# EAGLE design perch_pcb_v1 (EAGLE 7.6.0)
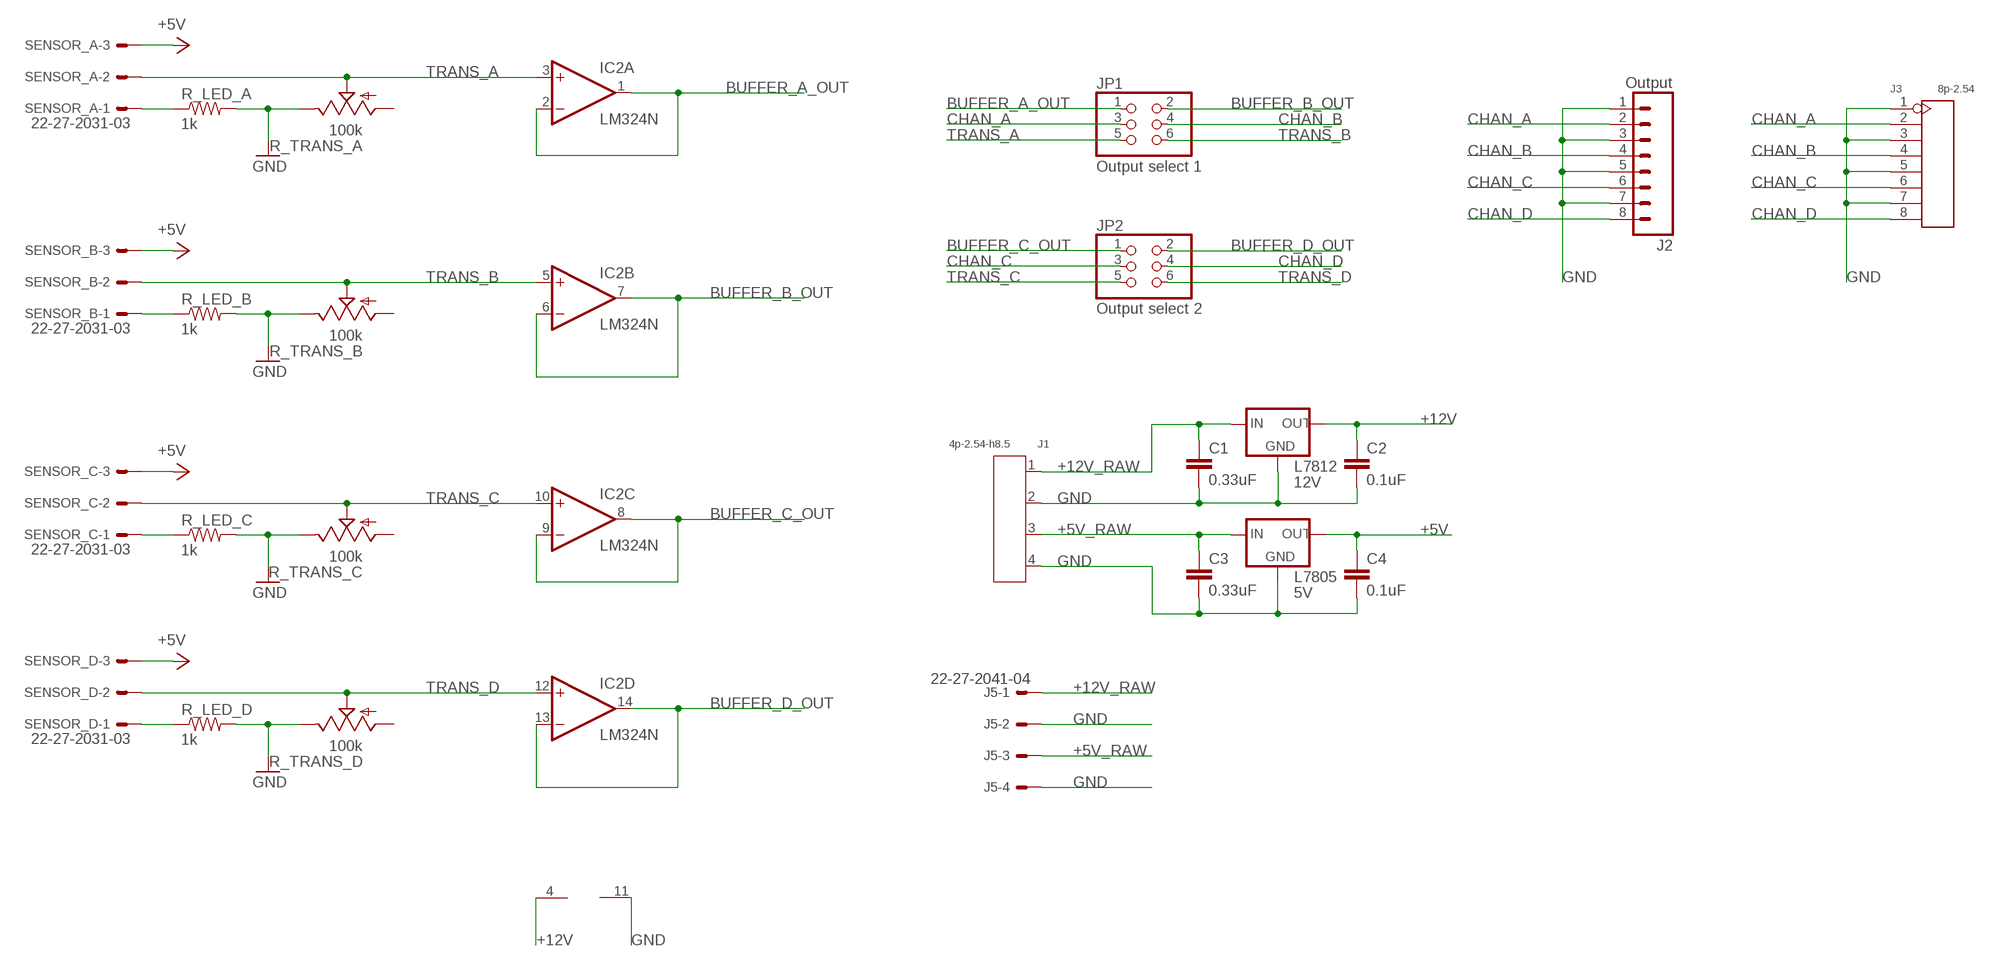
[diagram p0: schematic, sheet 1]

## Parts
C1  0.33uF  CAPPTH  [CAP-PTH-SMALL]
C2  0.1uF  CAPPTH  [CAP-PTH-SMALL]
C3  0.33uF  CAPPTH  [CAP-PTH-SMALL]
C4  0.1uF  CAPPTH  [CAP-PTH-SMALL]
IC2  LM324N  [DIL14]
J1  4p-2.54-h8.5  DIP-SCREW-TERMINAL-GREEN(4P-2.54-H8.5)  [H4-2.54-8.52X6.3MM]
J2  Output  M08  [1X08_ROUND]
J3  8p-2.54  DIP-SCREW-TERMINAL(8P-2.54)  [H8-2.54-18.7X6.3MM]
J5  22-27-2041-04  [6410-04]
JP1  Output select 1  PINHD-2X3  [2X03]
JP2  Output select 2  PINHD-2X3  [2X03]
L7805  5V  V_REG_78XXSINK  [TO220-IGO]
L7812  12V  V_REG_78XXSINK  [TO220-IGO]
R_LED_A  1k  RESISTORAXIAL-0.3  [AXIAL-0.3]
R_LED_B  1k  RESISTORAXIAL-0.3  [AXIAL-0.3]
R_LED_C  1k  RESISTORAXIAL-0.3  [AXIAL-0.3]
R_LED_D  1k  RESISTORAXIAL-0.3  [AXIAL-0.3]
R_TRANS_A  100k  TRIM_US-B64W  [B64W]
R_TRANS_B  100k  TRIM_US-B64W  [B64W]
R_TRANS_C  100k  TRIM_US-B64W  [B64W]
R_TRANS_D  100k  TRIM_US-B64W  [B64W]
SENSOR_A  22-27-2031-03  [6410-03]
SENSOR_B  22-27-2031-03  [6410-03]
SENSOR_C  22-27-2031-03  [6410-03]
SENSOR_D  22-27-2031-03  [6410-03]

## Nets
+5V: C4.1 L7805.OUT SENSOR_A.3 SENSOR_B.3 SENSOR_C.3 SENSOR_D.3
+5V_RAW: C3.1 J1.3 J5.3 L7805.IN
+12V: C2.1 IC2.4(P:V+) L7812.OUT
+12V_RAW: C1.1 J1.1 J5.1 L7812.IN
BUFFER_A_OUT: IC2.1(A:OUT) IC2.2(A:-IN) JP1.1
BUFFER_B_OUT: IC2.6(B:-IN) IC2.7(B:OUT) JP1.2
BUFFER_C_OUT: IC2.8(C:OUT) IC2.9(C:-IN) JP2.1
BUFFER_D_OUT: IC2.13(D:-IN) IC2.14(D:OUT) JP2.2
CHAN_A: J2.2 J3.2 JP1.3
CHAN_B: J2.4 J3.4 JP1.4
CHAN_C: J2.6 J3.6 JP2.3
CHAN_D: J2.8 J3.8 JP2.4
GND: C1.2 C2.2 C3.2 C4.2 IC2.11(P:V-) J1.2 J1.4 J2.1 J2.3 J2.5 J2.7 J3.1 J3.3 J3.5 J3.7 J5.2 J5.4 L7805.GND L7812.GND R_LED_A.P$2 R_LED_B.P$2 R_LED_C.P$2 R_LED_D.P$2 R_TRANS_A.E R_TRANS_B.E R_TRANS_C.E R_TRANS_D.E
N$1: R_LED_B.P$1 SENSOR_B.1
N$2: R_LED_A.P$1 SENSOR_A.1
N$3: R_LED_C.P$1 SENSOR_C.1
N$4: R_LED_D.P$1 SENSOR_D.1
TRANS_A: IC2.3(A:+IN) JP1.5 R_TRANS_A.S SENSOR_A.2
TRANS_B: IC2.5(B:+IN) JP1.6 R_TRANS_B.S SENSOR_B.2
TRANS_C: IC2.10(C:+IN) JP2.5 R_TRANS_C.S SENSOR_C.2
TRANS_D: IC2.12(D:+IN) JP2.6 R_TRANS_D.S SENSOR_D.2
Unconnected: R_TRANS_A.A R_TRANS_B.A R_TRANS_C.A R_TRANS_D.A

## Library data of the parts
C1-C4 = SparkFun-Capacitors:CAP: Capacitor Standard 0603 ceramic capacitor, and 0.1" leaded capacitor.
IC2 = linear:LM324: OP AMP
J1 = Seeed-OPL-Connector:DIP-SCREW-TERMINAL-GREEN(4P-2.54-H8.5): 320110118; MPN: GS019-2.54-4P-1
J2 = SparkFun-Connectors:M08: Header 8 Standard 8-pin 0.1" header. Use with straight break away headers (SKU : PRT-00116), right angle break away headers (PRT-00553), swiss pins (PRT-00743), machine pins (PRT-00117), and female headers (PRT-00115).; PROD_ID: CONN-08437
J3 = Seeed-OPL-Connector:DIP-SCREW-TERMINAL(8P-2.54): 320110147; MPN: GS019-8P-1
J5 = con-molex:22-?-04: CONNECTOR wire to board 2.54 mm (.1 inch) pitch header; OC_FARNELL: unknown; OC_NEWARK: unknown
JP1 JP2 = pinhead:PINHD-2X3: PIN HEADER
L7805 L7812 = SparkFun-PowerIC:V_REG_78XX: Voltage Regulator Standard 78xx regulator. IGO (Input Ground Output). Spark Fun Electronics SKU : COM-00107
R_LED_A R_LED_B R_LED_C R_LED_D = SparkFun-Passives:RESISTOR: Resistor Basic schematic elements and footprints for 0603, 1206, and PTH resistors.
R_TRANS_A R_TRANS_B R_TRANS_C R_TRANS_D = pot:TRIM_US-: POTENTIOMETER
SENSOR_A SENSOR_B SENSOR_C SENSOR_D = con-molex:22-?-03: CONNECTOR wire to board 2.54 mm (.1 inch) pitch header; OC_FARNELL: unknown; OC_NEWARK: unknown

## Net classes
0 default: width 0.254 mm, clearance 0.254 mm
1 supply: width 0.508 mm, clearance 0.508 mm

## Board
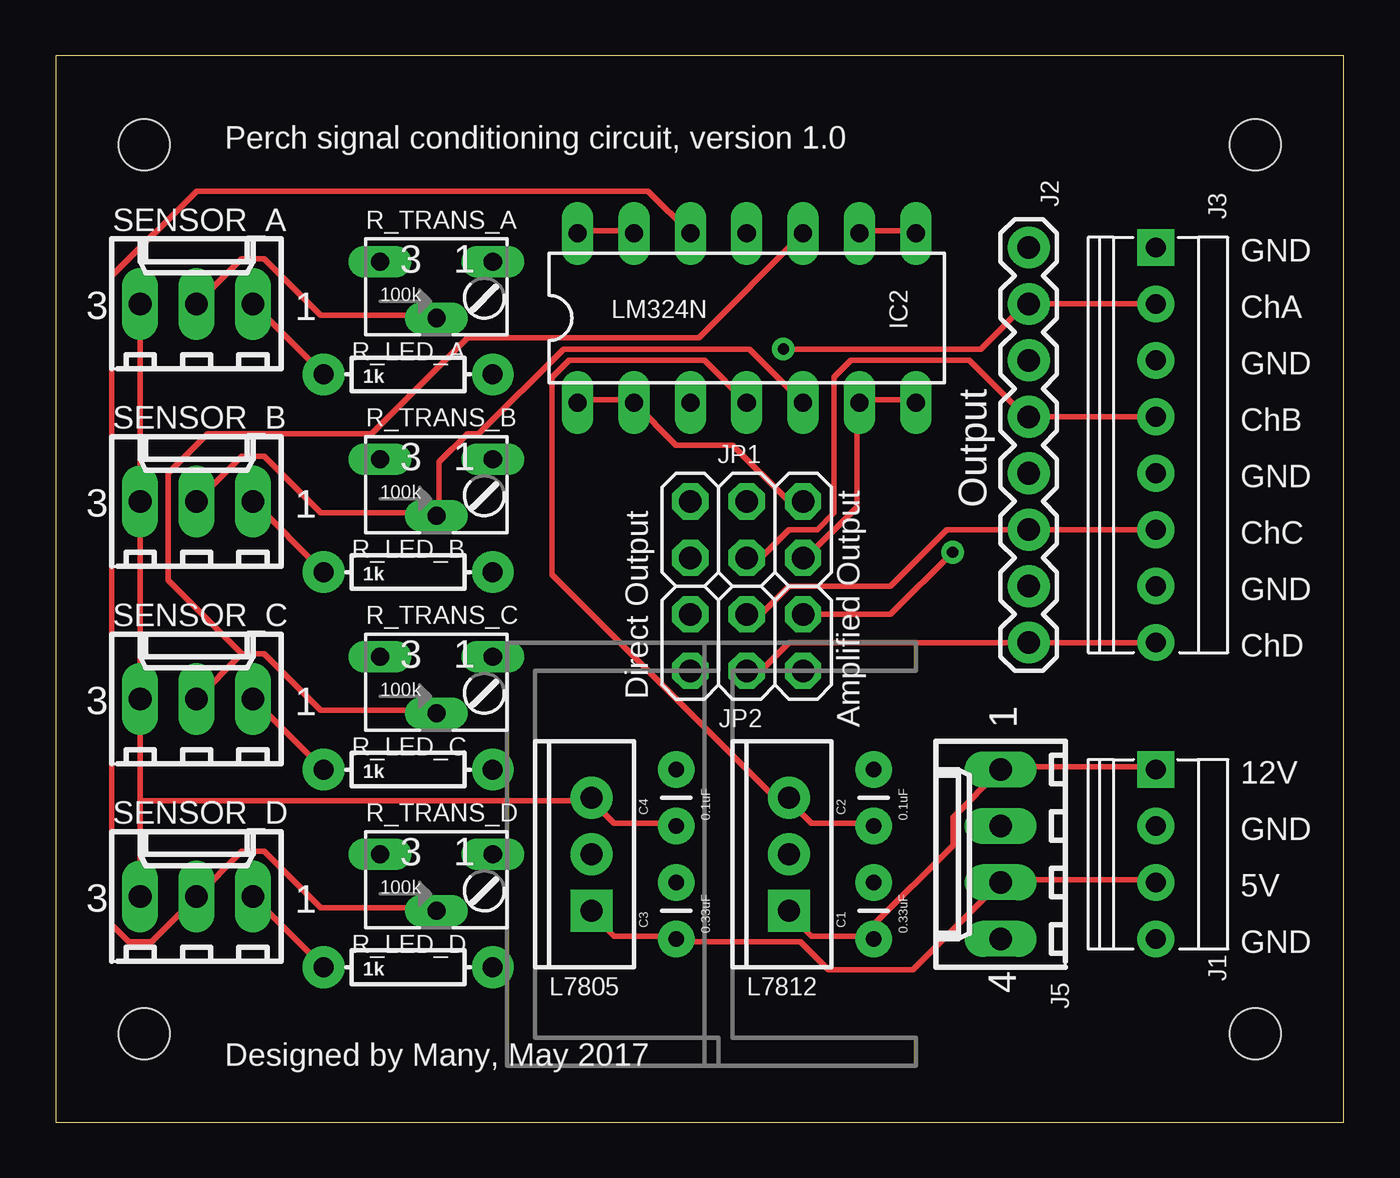
[diagram p1: board, top side]
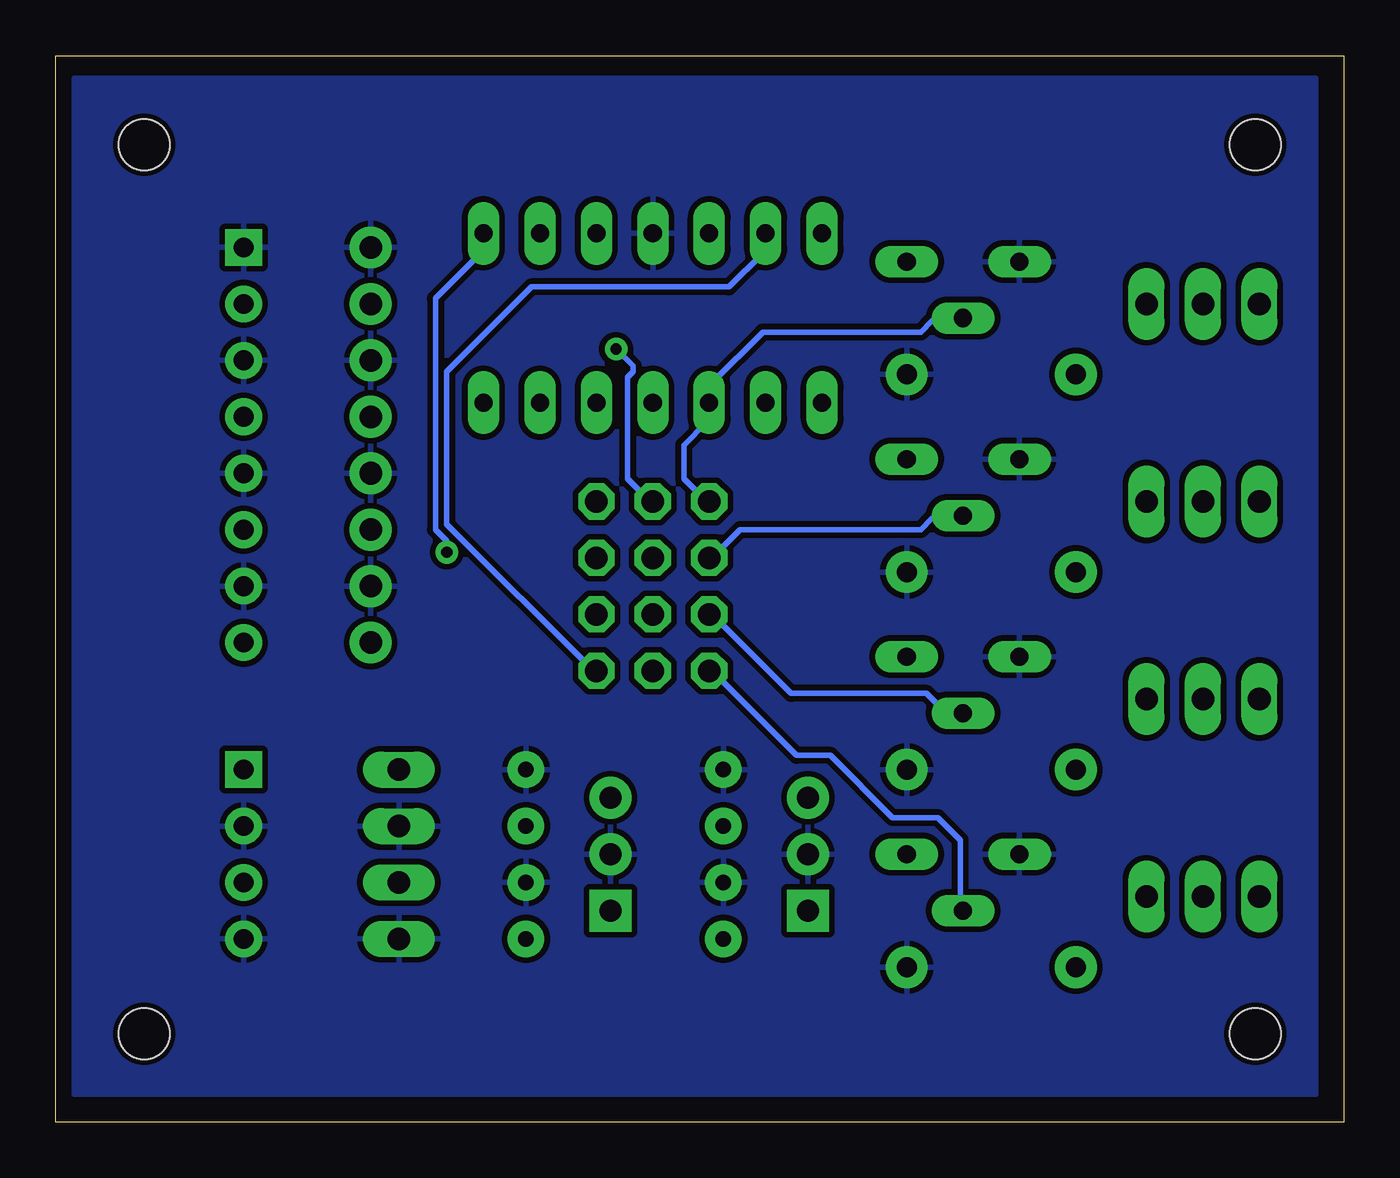
[diagram p2: board, bottom side, seen from below]

Size 58 x 48.01 mm. Coordinates in mm from the lower left corner, seen from the top.
Outline: 0,0 58,0 58,48.01 0,48.01 0,0
Copper layers (1*16): Top 0.035mm / dielectric 1.5mm / Bottom 0.035mm
Design rules "SparkFun": minimum track width 8mil, minimum drill 20mil, track to track 8mil, track to pad 8mil, pad to pad 8mil, via to via 8mil, smd to smd 8mil, copper to edge 10mil, drill to drill 8mil, minimum pad ring 12mil, minimum via ring 10mil, stop-mask expansion 4mil, vias tented up to drill 25mil, thermal gap 10mil
Holes 2.29 mm at 54,3.99 54,43.99 3.99,43.99 3.99,3.99

### Footprints (pad centres in the part's own frame; a part is rotated, then mirrored left to right if it is on the bottom)
CAP-PTH-SMALL = drill 0.7 pad 1.651: 1 0,0; 2 2.54,0
DIL14 = drill 0.813 long: 1 -7.62,-3.81; 2 -5.08,-3.81; 3 -2.54,-3.81; 4 0,-3.81; 5 2.54,-3.81; 6 5.08,-3.81; 7 7.62,-3.81; 8 7.62,3.81; 9 5.08,3.81; 10 2.54,3.81; 11 0,3.81; 12 -2.54,3.81; 13 -5.08,3.81; 14 -7.62,3.81
H4-2.54-8.52X6.3MM = drill 0.889 pad 1.651 square: 1 0,3.81 | drill 0.889 pad 1.651: 2 0,1.27; 3 0,-1.27; 4 0,-3.81
1X08_ROUND = drill 1.016 pad 1.88: 1 0,0; 2 2.54,0; 3 5.08,0; 4 7.62,0; 5 10.16,0; 6 12.7,0; 7 15.24,0; 8 17.78,0
H8-2.54-18.7X6.3MM = drill 0.889 pad 1.651 square: 1 0,8.89 | drill 0.889 pad 1.651: 2 0,6.35; 3 0,3.81; 4 0,1.27; 5 0,-1.27; 6 0,-3.81; 7 0,-6.35; 8 0,-8.89
6410-04 = drill 1.016 long: 1 3.81,0; 2 1.27,0; 3 -1.27,0; 4 -3.81,0
2X03 = drill 1.016 octagon: 1 -2.54,-1.27; 2 -2.54,1.27; 3 0,-1.27; 4 0,1.27; 5 2.54,-1.27; 6 2.54,1.27
TO220-IGO = drill 1 pad 1.88: GND 0,0; OUT 2.54,0 | drill 1 pad 1.88 square: IN -2.54,0
AXIAL-0.3 = drill 0.9 pad 1.88: P$1 -3.81,0; P$2 3.81,0
B64W = drill 0.813 long: A 2.54,0; E -2.54,0; S 0,-2.54
6410-03 = drill 1.016 long: 1 2.54,0; 2 0,0; 3 -2.54,0

### Placement (x,y rotation side)
C1  36.83,8.26 90 top
C2  36.83,13.34 90 top
C3  27.94,8.26 90 top
C4  27.94,13.34 90 top
IC2  31.11,36.2 0 top
J1  49.53,12.06 0 top
J2  43.81,39.37 270 top
J3  49.53,30.48 0 top
J5  42.55,12.06 90 top
JP1  31.11,26.67 180 top
JP2  31.11,21.59 180 top
L7805  24.13,12.06 90 top
L7812  33.02,12.06 90 top
R_LED_A  15.88,33.66 0 top
R_LED_B  15.88,24.77 0 top
R_LED_C  15.88,15.88 0 top
R_LED_D  15.88,6.99 0 top
R_TRANS_A  17.14,38.73 0 top
R_TRANS_B  17.14,29.84 0 top
R_TRANS_C  17.14,20.95 0 top
R_TRANS_D  17.14,12.06 0 top
SENSOR_A  6.35,36.83 0 top
SENSOR_B  6.35,27.94 0 top
SENSOR_C  6.35,19.05 0 top
SENSOR_D  6.35,10.16 0 top

### Tracks (layer width: path | path; a pad name or v marks a point on that pad's centre or on a via)
+5V
  Top 0.254: SENSOR_A.3 SENSOR_B.3 SENSOR_C.3 3.81,14.48 | 24.13,14.48 25.15,13.46 27.94,13.46 C4.1 | 3.81,14.48 SENSOR_D.3 | 3.81,14.48 24.13,14.48 | 24.13,14.48 L7805.OUT
+5V_RAW
  Top 0.254: L7805.IN 24.13,9.4 25.15,8.38 27.94,8.38 C3.1 27.94,8.13 33.53,8.13 34.8,6.86 38.61,6.86 J5.3 42.67,10.92 49.53,10.92 J1.3
+12V
  Top 0.254: IC2.4 29.21,34.29 23.11,34.29 22.35,33.53 22.35,24.64 32.26,14.73 33.02,14.73 L7812.OUT 33.02,14.48 34.04,13.46 36.83,13.46 C2.1
+12V_RAW
  Top 0.254: 36.83,8.38 34.04,8.38 33.02,9.4 L7812.IN | J1.1 49.53,16 42.67,16 J5.1 40.39,13.72 40.39,12.45 36.83,8.89 36.83,8.38 | 36.83,8.38 C1.1
BUFFER_A_OUT
  Top 0.254: IC2.1 23.62,32.51 25.91,32.51 IC2.2 27.94,30.48 30.48,30.48 33.02,27.94 JP1.1
BUFFER_B_OUT
  Top 0.254: IC2.7 38.61,32.51 36.32,32.51 IC2.6 36.07,32.26 36.07,27.69 33.78,25.4 JP1.2
BUFFER_C_OUT  (via drill 0.51)
  Top 0.254: IC2.9 36.32,40.13 38.61,40.13 IC2.8 | JP2.1 37.59,22.86 v40.39,25.65
  Bottom 0.254: v40.39,25.65 40.39,26.16 40.89,26.67 40.89,37.08 38.86,39.12 38.86,39.88 IC2.8
BUFFER_D_OUT
  Top 0.254: IC2.14 23.62,40.13 25.91,40.13 IC2.13
  Bottom 0.254: JP2.2 33.78,20.32 40.39,26.92 40.39,33.78 36.58,37.59 27.69,37.59 26.16,39.12 26.16,39.88 IC2.13
CHAN_A  (via drill 0.51)
  Top 0.254: v32.77,34.8 41.66,34.8 43.69,36.83 J2.2 J3.2
  Bottom 0.254: v32.77,34.8 32,34.04 32,33.78 32.26,33.53 32.26,28.96 31.24,27.94 JP1.3
CHAN_B
  Top 0.254: JP1.4 31.75,25.4 33.02,26.67 34.29,26.67 35.05,27.43 35.05,33.53 35.81,34.29 41.15,34.29 43.69,31.75 J2.4 J3.4
CHAN_C
  Top 0.254: JP2.3 31.75,22.86 33.02,24.13 37.59,24.13 40.13,26.67 J2.6 J3.6
CHAN_D
  Top 0.254: JP2.4 31.75,20.32 33.02,21.59 J2.8 J3.8
GND
  pour Bottom: 1.27,46.99 1.27,1.27 57.15,1.27 57.15,46.99
N$1
  Top 0.254: R_LED_B.P$1 SENSOR_B.1
N$2
  Top 0.254: R_LED_A.P$1 SENSOR_A.1
N$3
  Top 0.254: R_LED_C.P$1 SENSOR_C.1
N$4
  Top 0.254: R_LED_D.P$1 SENSOR_D.1
TRANS_A
  Top 0.254: SENSOR_A.2 8.38,38.86 9.4,38.86 11.94,36.32 17.02,36.32 R_TRANS_A.S
  Bottom 0.254: JP1.5 28.7,27.94 29.72,28.96 29.72,30.48 28.7,31.5 28.7,32.26 IC2.3 28.45,32.51 28.45,33.27 26.16,35.56 19.05,35.56 18.54,36.07 17.27,36.07 R_TRANS_A.S
TRANS_B
  Top 0.254: SENSOR_B.2 8.38,29.97 9.4,29.97 11.94,27.43 17.02,27.43 R_TRANS_B.S 17.27,27.43 17.27,29.72 18.54,30.99 19.05,30.99 22.86,34.8 31.24,34.8 IC2.5
  Bottom 0.254: JP1.6 28.45,25.4 27.18,26.67 19.05,26.67 18.54,27.18 17.27,27.18 R_TRANS_B.S
TRANS_C
  Top 0.254: 8.38,21.08 9.4,21.08 11.94,18.54 17.02,18.54 R_TRANS_C.S | SENSOR_C.2 8.38,21.08 | IC2.10 28.96,35.31 18.54,35.31 14.22,30.99 6.86,30.99 5.08,29.21 5.08,24.38 8.38,21.08
  Bottom 0.254: JP2.5 28.45,22.86 24.89,19.3 18.8,19.3 18.03,18.54 17.27,18.54 R_TRANS_C.S
TRANS_D
  Top 0.254: R_TRANS_D.S 17.02,9.65 11.94,9.65 9.4,12.19 8.38,12.19 SENSOR_D.2 4.32,8.13 3.3,8.13 2.54,8.89 2.54,38.1 6.35,41.91 26.67,41.91 IC2.12
  Bottom 0.254: JP2.6 28.45,20.32 24.64,16.51 23.11,16.51 20.32,13.72 18.29,13.72 17.27,12.7 17.27,9.65 R_TRANS_D.S

### Text on the board
tPlace: Perch signal conditioning circuit, version 1.0 | GND | ChA | GND | ChB | GND | ChC | GND | ChD | Direct Output | Amplified Output | 12V | GND | 5V | GND | Designed by Many, May 2017